# EAGLE design roomba interface 1.1 (EAGLE 6.4)
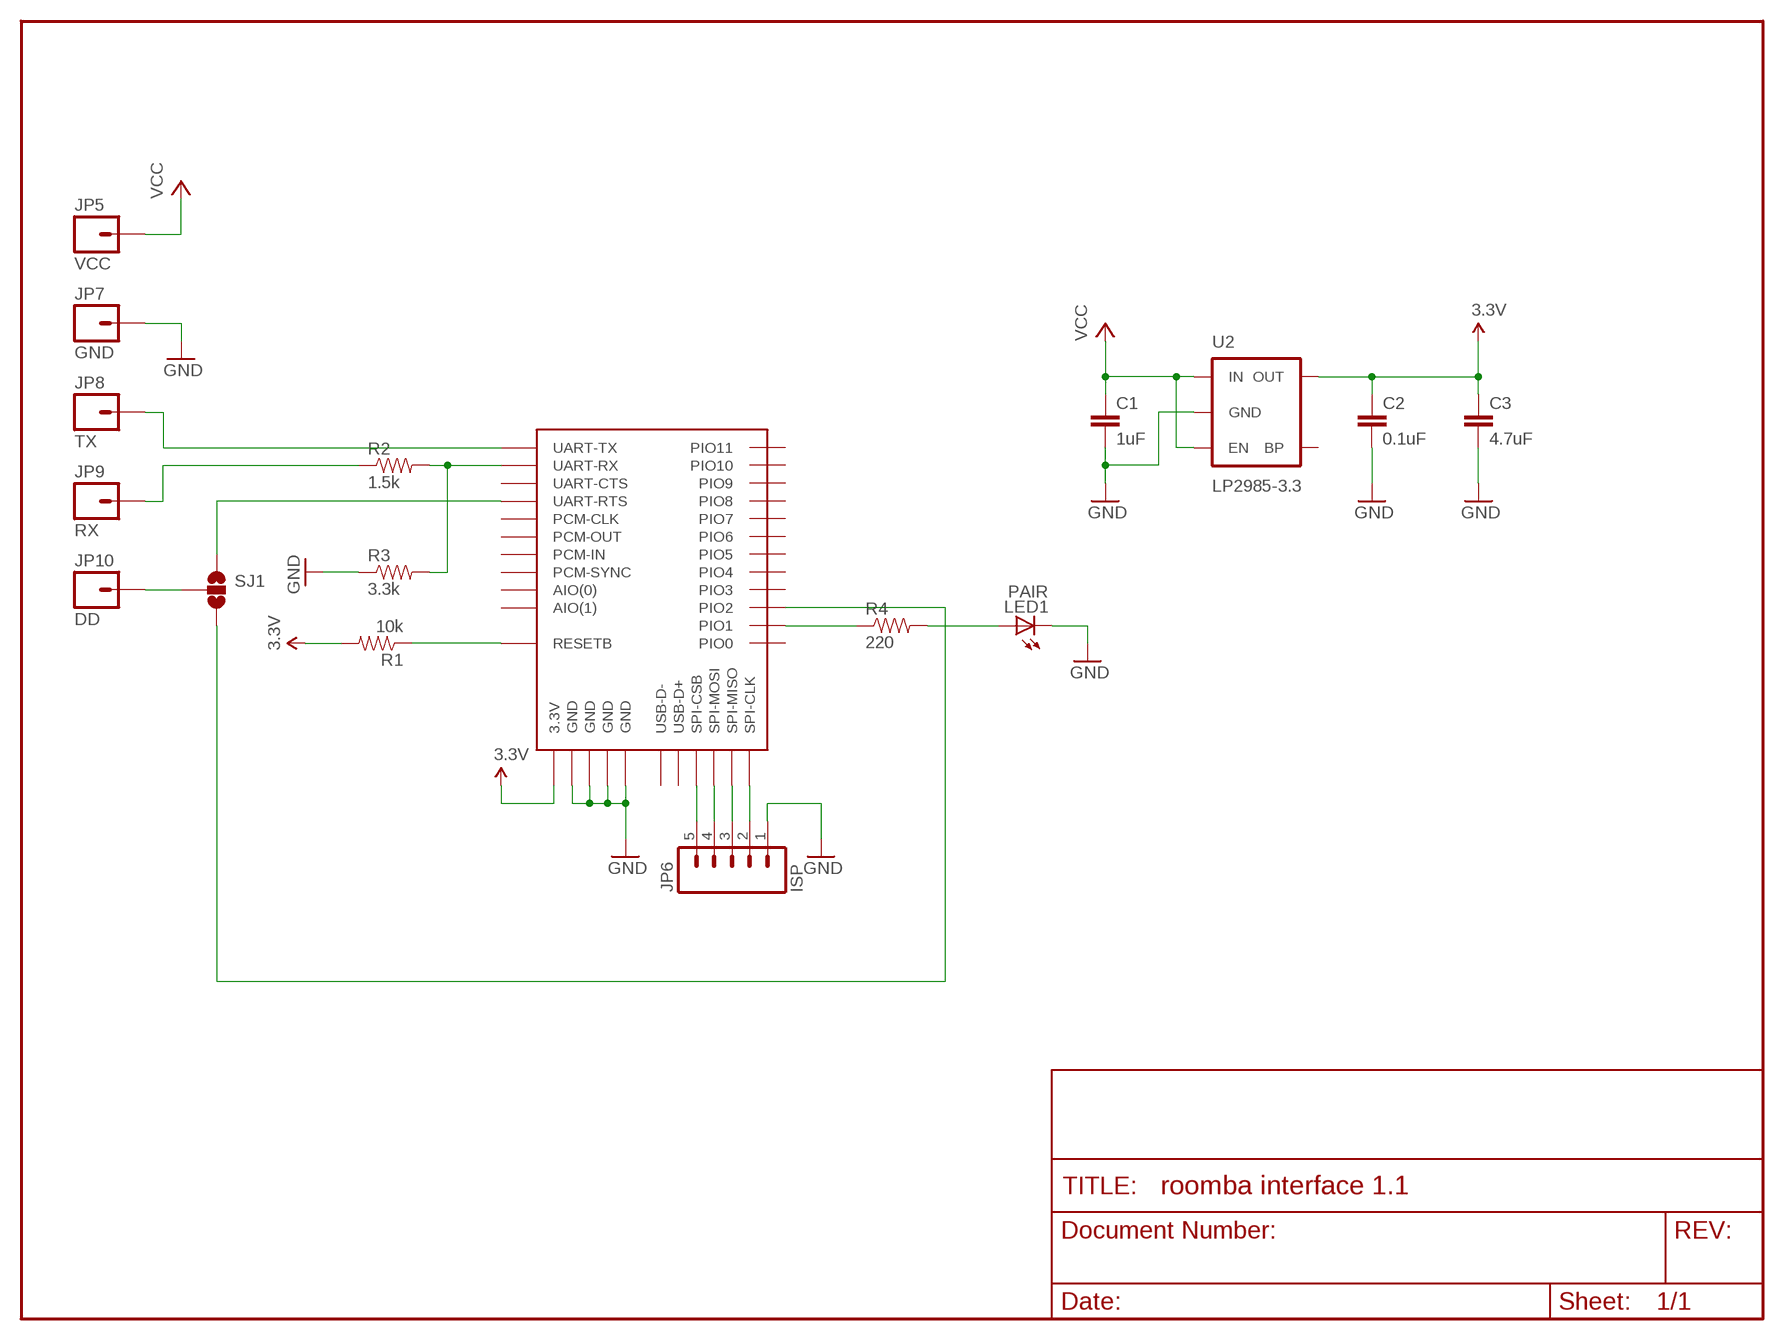
[diagram p0: schematic, sheet 1]

## Parts
C1  1uF  CAP0805  [0805]
C2  0.1uF  CAP0805  [0805]
C3  4.7uF  CAP0805  [0805]
JP5  VCC  M01PTH  [1X01]
JP6  ISP  M05PTH  [1X05]
JP7  GND  M01PTH  [1X01]
JP8  TX  M01PTH  [1X01]
JP9  RX  M01PTH  [1X01]
JP10  DD  M01PTH  [1X01]
LED1  PAIR  LED0603  [LED-0603]
R1  10k  RESISTOR0805-RES  [0805]
R2  1.5k  RESISTOR0805-RES  [0805]
R3  3.3k  RESISTOR0805-RES  [0805]
R4  220  RESISTOR0805-RES  [0805]
SJ1  SOLDERJUMPER_2WAYT  [SJ_2]
U2  LP2985-3.3  V_REG_LDOSMD  [SOT23-5]
U$1  BTM400_6B  [BTM400_6B]

## Nets
3.3V: C2.1 C3.1 R1.2 U2.5(OUT) U$1.3.3V
GND: C1.2 C2.2 C3.2 JP6.1 JP7.1 LED1.C R3.1 U2.2(GND) U$1.GND@1(GND) U$1.GND@2(GND) U$1.GND@3(GND) U$1.GND@4(GND)
N$1: R1.1 U$1.RESETB
N$2: JP9.1 R2.1
N$3: R2.2 R3.2 U$1.UART-RX
N$4: JP8.1 U$1.UART-TX
N$5: JP6.5 U$1.SPI-CSB
N$6: JP6.4 U$1.SPI-MOSI
N$7: JP6.3 U$1.SPI-MISO
N$8: JP6.2 U$1.SPI-CLK
N$9: SJ1.1 U$1.UART-RTS
N$10: R4.1 U$1.PIO(1)(PIO1)
N$11: LED1.A R4.2
N$12: JP10.1 SJ1.2
N$13: SJ1.3 U$1.PIO(2)(PIO2)
VCC: C1.1 JP5.1 U2.1(IN) U2.3(EN)
Unconnected: U2.4(BP) U$1.AIO(0) U$1.AIO(1) U$1.PCM-CLK U$1.PCM-IN U$1.PCM-OUT U$1.PCM-SYNC U$1.PIO(0)(PIO0) U$1.PIO(3)(PIO3) U$1.PIO(4)(PIO4) U$1.PIO(5)(PIO5) U$1.PIO(6)(PIO6) U$1.PIO(7)(PIO7) U$1.PIO(8)(PIO8) U$1.PIO(9)(PIO9) U$1.PIO(10)(PIO10) U$1.PIO(11)(PIO11) U$1.UART-CTS U$1.USB-D+ U$1.USB-D-

## Library data of the parts
C1-C3 = SparkFun:CAP: Capacitor Standard 0603 ceramic capacitor, and 0.1" leaded capacitor.
JP5 JP7-JP10 = SparkFun:M01: Header 1 Standard 1-pin 0.1" header. Use with straight break away headers (SKU : PRT-00116), right angle break away headers (PRT-00553), swiss pins (PRT-00743), machine pins (PRT-00117), and female headers (PRT-00115).
JP6 = SparkFun:M05: Header 5 Standard 5-pin 0.1" header. Use with straight break away headers (SKU : PRT-00116), right angle break away headers (PRT-00553), swiss pins (PRT-00743), machine pins (PRT-00117), and female headers (PRT-00115). Molex polarized connector foot print use with SKU : PRT-08230 with associated crimp pins and housings.
LED1 = SparkFun:LED: LEDs Standard schematic elements and footprints for 5mm, 3mm, 1206, and 0603 sized LEDs. 5mm - Spark Fun Electronics SKU : COM-00529 (and others)
R1-R4 = SparkFun:RESISTOR: Resistor Basic schematic elements and footprints for 0603, 1206, and PTH resistors.
SJ1 = SparkFun:SOLDERJUMPER_2WAY: Solder Jumper 2 way solder jumper
U2 = SparkFun:V_REG_LDO: Voltage Regulator LDO Standard 150mA LDO voltage regulator in SOT-23 layout. Micrel part MIC5205. BP (by-pass) pin is used to lower output noise with 470pF cap.
U$1 = misc:BTM400_6B

## Board
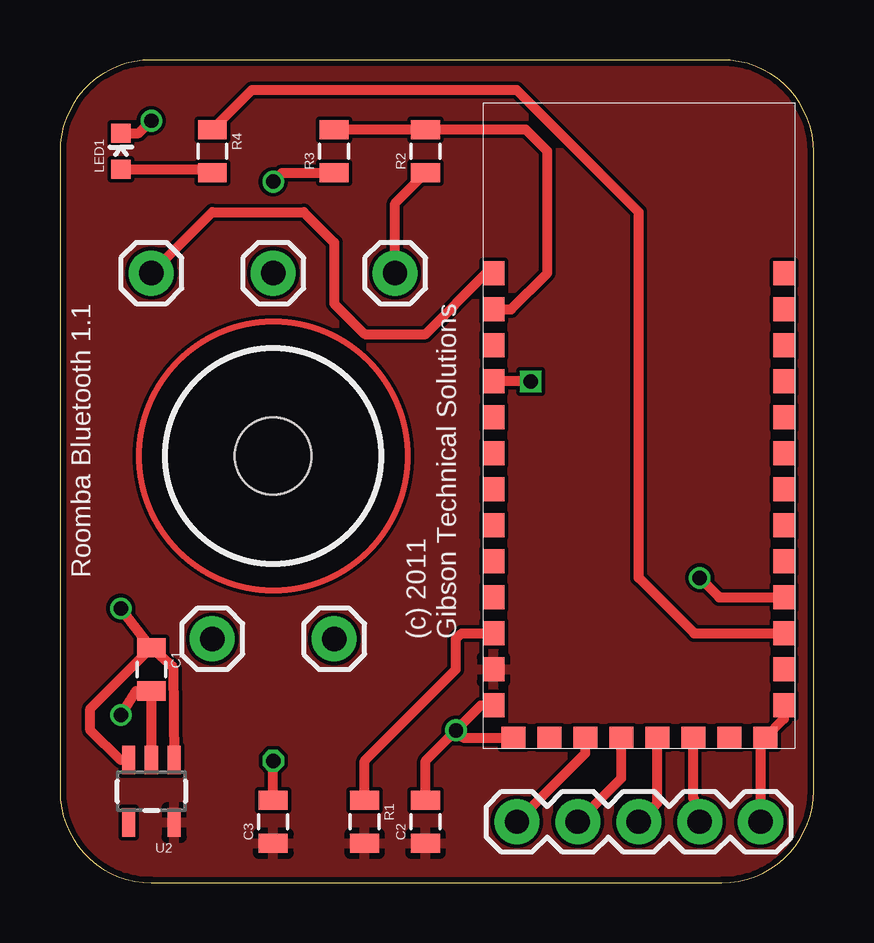
[diagram p1: board, top side]
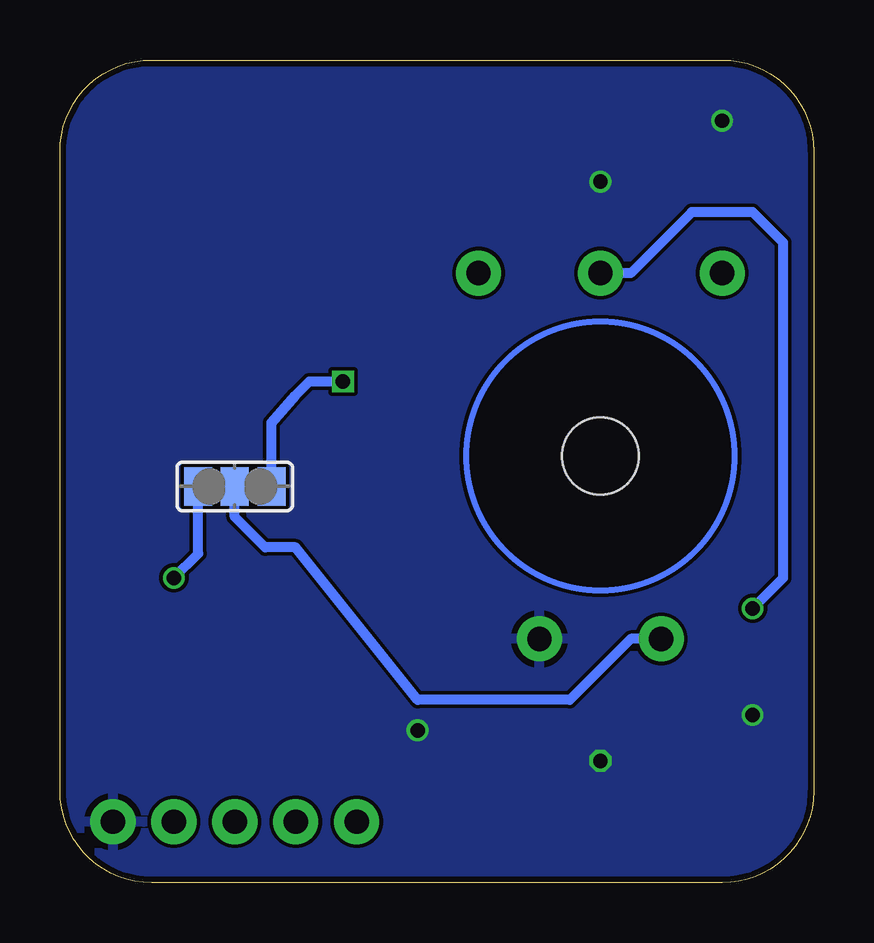
[diagram p2: board, bottom side, seen from below]

Size 31.42 x 34.28 mm. Coordinates in mm from the lower left corner, seen from the top.
Outline: 3.8,34.28 arc90 0,30.48 0,3.81 arc90 3.81,0 27.6,0 arc90 31.42,3.82 31.42,30.47 arc90 27.61,34.28 3.8,34.28
Copper layers (1*16): Top 0.035mm / dielectric 1.5mm / Bottom 0.035mm
Design rules "ITead_rule": minimum track width 6mil, minimum drill 12mil, track to track 6mil, track to pad 6mil, pad to pad 6mil, via to via 6mil, smd to smd 0mil, copper to edge 10mil, drill to drill 10mil, minimum pad ring 10mil, minimum via ring 6mil, stop-mask expansion 2mil, vias tented up to drill 100mil, thermal gap 10mil
Holes 3.2 mm at 8.89,17.78

### Footprints (pad centres in the part's own frame; a part is rotated, then mirrored left to right if it is on the bottom)
0805 = smd 0.8 x 1.2: 1 -0.9,0; 2 0.9,0
1X01 = drill 1.016 pad 1.88: 1 0,0
1X05 = drill 1.016 pad 1.88: 1 0,0; 2 2.54,0; 3 5.08,0; 4 7.62,0; 5 10.16,0
LED-0603 = smd 0.8 x 0.8: A 0,-0.75; C 0,0.75
SJ_2 = smd 1.168 x 1.6: 1 -1.524,0; 2 0,0; 3 1.524,0
SOT23-5 = smd 0.55 x 1.2: 1 -0.95,-1.3; 2 0,-1.3; 3 0.95,-1.3; 4 0.95,1.3; 5 -0.95,1.3
BTM400_6B = smd 0.9 x 1: 3.3V -6.05,-10.16; AIO(0) -6.05,-5.66; AIO(1) -6.05,-7.16; GND@1 -6.05,-11.66; GND@4 6.05,-11.66; PCM-CLK -6.05,0.34; PCM-IN -6.05,-2.66; PCM-OUT -6.05,-1.16; PCM-SYNC -6.05,-4.16; PIO(0) 6.05,-10.16; PIO(1) 6.05,-8.66; PIO(2) 6.05,-7.16; PIO(3) 6.05,-5.66; PIO(4) 6.05,-4.16; PIO(5) 6.05,-2.66; PIO(6) 6.05,-1.16; PIO(7) 6.05,0.34; PIO(8) 6.05,1.84; PIO(9) 6.05,3.34; PIO(10) 6.05,4.84; PIO(11) 6.05,6.34; RESETB -6.05,-8.66; UART-CTS -6.05,3.34; UART-RTS -6.05,1.84; UART-RX -6.05,4.84; UART-TX -6.05,6.34 | smd 1 x 0.9: GND@2 -5.23,-13; GND@3 5.27,-13; SPI-CLK 2.27,-13; SPI-CSB -2.23,-13; SPI-MISO 0.77,-13; SPI-MOSI -0.73,-13; USB-D+ 3.77,-13; USB-D- -3.73,-13

### Placement (x,y rotation side)
C1  3.81,8.89 270 top
C2  15.24,2.54 90 top
C3  8.89,2.54 90 top
JP5  8.89,25.4 0 top
JP6  29.21,2.54 180 top
JP7  11.43,10.16 0 top
JP8  3.81,25.4 0 top
JP9  13.97,25.4 0 top
JP10  6.35,10.16 0 top
LED1  2.54,30.48 0 top
R1  12.7,2.54 270 top
R2  15.24,30.48 90 top
R3  11.43,30.48 90 top
R4  6.35,30.48 270 top
SJ1  24.13,16.51 180 bottom
U2  3.81,3.81 180 top
U$1  24.13,19.05 0 top

### Tracks (layer width: path | path; a pad name or v marks a point on that pad's centre or on a via)
3.3V
  pour Top: 3.81,0 arc-90 0,3.81 0,30.48 arc-90 3.81,34.29 27.94,34.29 arc-90 31.75,30.48 31.75,5.08 arc-90 26.67,0
GND  (via drill 0.6)
  Top 0.406: C3.2 v8.89,5.08 | JP6.1 29.21,5.86 U$1.GND@3 30.18,6.83 U$1.GND@4 | U$1.GND@1 17.55,7.39 v16.51,6.35 | U$1.GND@2 16.81,6.05 v16.51,6.35 | C2.2 15.24,5.08 v16.51,6.35 | R3.1 9.26,29.58 v8.89,29.21 | U2.2 C1.2 3.18,7.99 v2.54,6.98 | LED1.C 3.29,31.23 v3.81,31.75
  pour Bottom: 3.81,0 arc-90 0,3.81 0,30.48 arc-90 3.81,34.29 27.94,34.29 arc-90 31.75,30.48 31.75,5.08 arc-90 26.67,0
N$1
  Top 0.406: U$1.RESETB 16.74,10.39 16.51,10.16 16.51,8.89 12.7,5.08 R1.1
N$2
  Top 0.406: JP9.1 13.97,28.31 R2.1
N$3
  Top 0.406: R3.2 R2.2 19.42,31.38 20.32,30.48 20.32,25.4 18.81,23.89 U$1.UART-RX
N$4
  Top 0.406: U$1.UART-TX 17.77,25.39 15.24,22.86 12.7,22.86 11.43,24.13 11.43,26.67 10.16,27.94 6.35,27.94 JP8.1
N$5
  Top 0.406: U$1.SPI-CSB 21.9,5.39 JP6.5
N$6
  Top 0.406: U$1.SPI-MOSI 23.4,4.35 JP6.4
N$7
  Top 0.406: U$1.SPI-MISO 24.9,3.31 JP6.3
N$8
  Top 0.406: U$1.SPI-CLK 26.4,3.54 JP6.2
N$9  (via drill 0.6)
  Top 0.406: v19.62,20.89 U$1.UART-RTS
  Bottom 0.406: v19.62,20.89 21.02,20.89 21.59,20.32 22.61,19.17 SJ1.1
N$10
  Top 0.406: R4.1 7.99,33.02 19.05,33.02 24.13,27.94 24.13,12.7 26.44,10.39 U$1.PIO(1)
N$11
  Top 0.406: LED1.A 6.2,29.73 R4.2
N$12
  Bottom 0.406: JP10.1 7.62,10.16 10.16,7.62 16.51,7.62 21.59,13.97 22.86,13.97 24.13,15.24 SJ1.2
N$13  (via drill 0.6)
  Top 0.406: v26.67,12.7 27.48,11.89 U$1.PIO(2)
  Bottom 0.406: SJ1.3 25.65,13.72 v26.67,12.7
VCC  (via drill 0.6)
  Top 0.406: C1.1 v2.54,11.43 | C1.1 4.71,8.97 U2.1 | U2.3 2.54,5.11 1.27,6.35 1.27,7.25 C1.1
  Bottom 0.406: JP5.1 7.62,25.4 5.08,27.94 2.54,27.94 1.27,26.67 1.27,12.7 v2.54,11.43
(copper drawn outside any net)
  shapes: Bottom circle x1, Top circle x1

### Text on the board
tPlace: Roomba Bluetooth 1.1 | (c) 2011 | Gibson Technical Solutions